# Altium schematic sheet BypassUnit.SchDoc
size A4
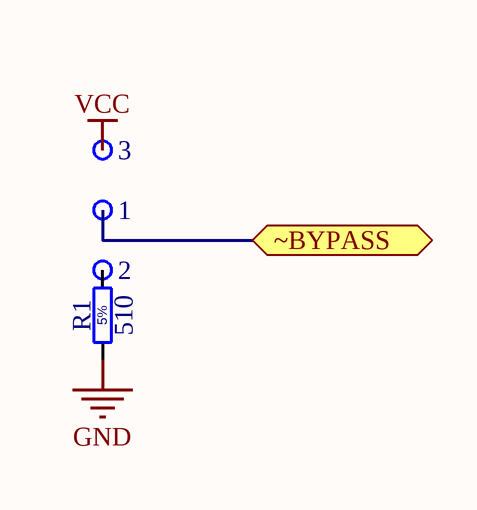
[diagram p0: BypassUnit.SchDoc]

## Parts
1  Plated Hole  [c180h130]  (value not drawn)
2  Plated Hole  [c180h130]  (value not drawn)
3  Plated Hole  [c180h130]  (value not drawn)
R1  510  [RES_ARCOL_RCC025]

## Ports
~BYPASS

## Nets
GND: R1.1
VCC: 3.1
~BYPASS: 1.1 ; port ~BYPASS
Net2_1: 2.1 R1.2

## Notes on the sheet
- (in symbol RCF_5K1_5%_0.25W_+10-6PPM_ARCOL_RCC025) 5%

## Library data of the parts
1-3 = PLATED_HOLE1.3_PAD1.8: Single Terminal Socket; Part Description: Plated Through Hole: Hole Dia.=1.3mm Pad Dia.=1.8mm; Mounted: No; Table: Pads; Part Number: PLATED_HOLE1.3_PAD1.8; Component Kind: Standard (No BOM); Component Type: Standard (No BOM); Pin Count: 1; Family: Plated Hole; Socket: No; SMD: No; Status: None; ComponentHeight: 0mm; Author: CERN DEM JLC; CreateDate: 30.10.2008; LatestRevisionDate: 30.10.2008; PackageDescription: Plated Through Hole: Hole Dia.=1.3mm Pad Dia.=1.8mm
R1 = RCF_5K1_5%_0.25W_+10-6PPM_ARCOL_RCC025: Resistor - 5%; Part Description: Solid Carbon Resistor RCC Series; Manufacturer: ARCOL; Manufacturer Part Number: RCC025 5k1 J; Power: 0.25W; TC: +10-6ppm/°C; Table: Resistors THD; Part Number: RCF_5K1_5%_0.25W_+10-6PPM_ARCOL_RCC025; Component Kind: Standard; Component Type: Standard; Pin Count: 2; Value: 510; Status: None; Tolerance: ±5%; Case: LS10.16 L6.3 x D2.4; Mounted: Yes; Socket: No; SMD: No; ComponentHeight: 2.5mm; HelpURL: \\cern.ch\dfs\Applications\Altium\Datasheets\RCF_ARCOL_RCC025.pdf; Author: CERN DEM JLC; CreateDate: 30.10.2013; LatestRevisionDate: 30.10.2013